# Altium schematic sheet Reader.SchDoc
size A4
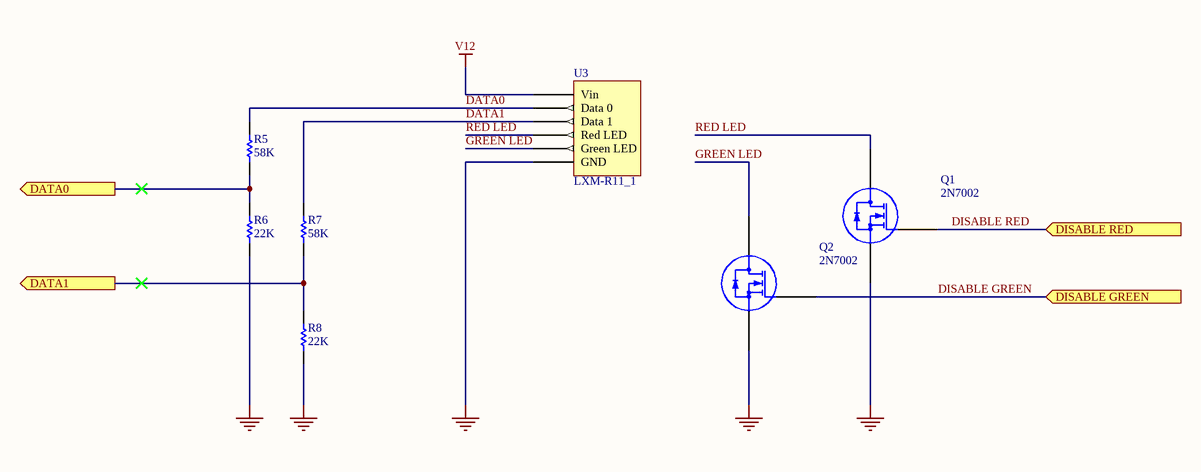
[diagram p0: Reader.SchDoc]

## Parts
Q1  2N7002  [TO-236AB]
Q2  2N7002  [TO-236AB]
R5  58K  [RES 0603]  (no BOM)
R6  22K  [RES 0603]  (no BOM)
R7  58K  [RES 0603]  (no BOM)
R8  22K  [RES 0603]  (no BOM)
U3  LXM-R11_1  [Bornier 6 pin]

## Ports
DATA0 (out), DATA1 (out), DISABLE GREEN (in), DISABLE RED (in)

## Nets
GND: Q1.2(S) Q2.2(S) R6.1 R8.1 U3.6(GND)
V12: U3.1(Vin)
DATA0: R5.2 U3.2(Data_0)
DATA0: R5.1 R6.2 ; port DATA0  [a separate net that carries the same name]
DATA1: R7.2 U3.3(Data_1)
DATA1: R7.1 R8.2 ; port DATA1  [a separate net that carries the same name]
DISABLE GREEN: Q2.1(G) ; port DISABLE GREEN
DISABLE RED: Q1.1(G) ; port DISABLE RED
GREEN LED: Q2.3(D) U3.5(Green_LED)
RED LED: Q1.3(D) U3.4(Red_LED)

## Notes on the sheet
- Title
- Size:
- Date:
- A4
- Number:
- Time:
- Revision:
- Sheet
- of
- File:

## Library data of the parts
Q1 Q2 = 2N7002: Transistor MOSFET, Canal N, 300 mA, 60 V, 2.8 ohm, 10 V, 2 V; Fabricant: NEXPERIA; Fournisseur: Farnell; RefFabricant: 2N7002,215; RefFournisseur: 1510761
R5 R7 = Res1: Resistor; Value: 100K; Fournisseur: Farnell; RefFournisseur: 1108917; Fabricant: WELWYN; RefFabricant: PCF0805-13-100K-B-T1; Published: 8-Jun-2000; LatestRevisionDate: 17-Jul-2002; LatestRevisionNote: Re-released for DXP Platform.; PackageReference: AXIAL-0.3; Publisher: Altium Limited; PackageDescription: Axial Device, Thru-Hole; 2 Leads; 0.3 in Pin Spacing
R6 R8 = Res1: Resistor; Value: 1K; Fournisseur: Farnell; RefFournisseur: 1353268; Fabricant: WELWYN; RefFabricant: PCF0805R-38K3BT1; Published: 8-Jun-2000; LatestRevisionDate: 17-Jul-2002; LatestRevisionNote: Re-released for DXP Platform.; PackageReference: AXIAL-0.3; Publisher: Altium Limited; PackageDescription: Axial Device, Thru-Hole; 2 Leads; 0.3 in Pin Spacing
U3 = LXM-R11_1: Lecteur RFid; Fabricant: STid; RefFabricant: LXM-R11; Fournisseur: *; RefFournisseur: *